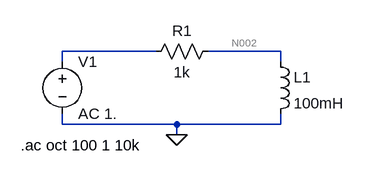
[diagram p0: schematic Bobina en AC.asc]
Bobina en AC.asc, the LTspice schematic file:
Version 4
SHEET 1 880 680
WIRE 128 112 -16 112
WIRE 320 112 208 112
WIRE -16 128 -16 112
WIRE 320 128 320 112
WIRE -16 224 -16 208
WIRE 160 224 -16 224
WIRE 320 224 320 208
WIRE 320 224 160 224
WIRE 160 240 160 224
FLAG 160 240 0
SYMBOL res 112 128 R270
WINDOW 0 32 56 VTop 2
WINDOW 3 0 56 VBottom 2
SYMATTR InstName R1
SYMATTR Value 1k
SYMBOL voltage -16 112 R0
WINDOW 123 0 0 Left 0
WINDOW 39 0 0 Left 0
SYMATTR InstName V1
SYMATTR Value AC 1.
SYMBOL ind 304 112 R0
SYMATTR InstName L1
SYMATTR Value 100mH
TEXT -80 256 Left 2 !.ac oct 100 1 10k

The netlist it stands for:
* Bobina en AC.asc
R1 N001 N002 1k
V1 N001 0 AC 1.
L1 N002 0 100mH
.ac oct 100 1 10k
.backanno
.end

* Results of the author's LTspice run, read from the files saved beside the schematic
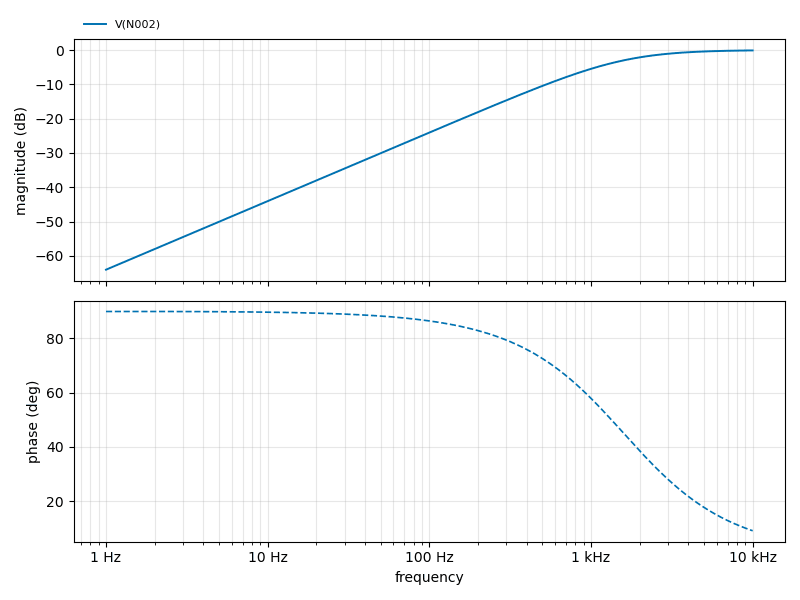
[diagram p1: AC Analysis of Bobina en AC.asc, plotted from the saved traces]
* AC Analysis, 1 run:
*   V(N002): -64.04 dB at 1 Hz, -0.11 dB at 10 kHz, peak -0.11 dB at 10 kHz, 3 dB below the peak at 1.553 kHz